# Altium schematic sheet Sheet1.SchDoc
size A4; SheetNumber: 1; SheetTotal: 1
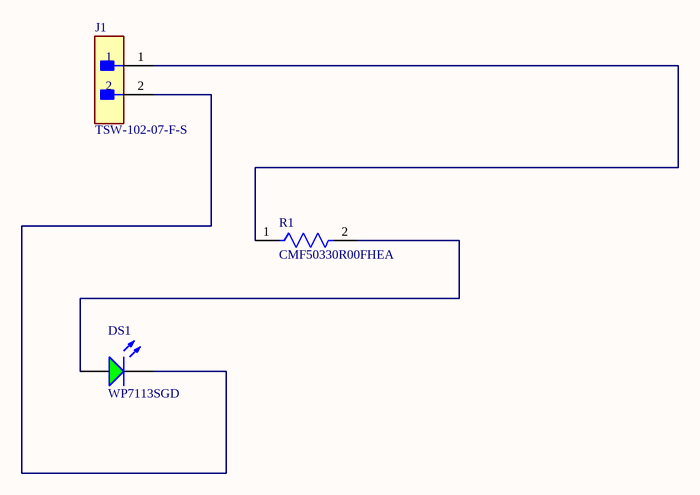
[diagram p0: Sheet1.SchDoc]

## Parts
DS1  WP7113SGD  [KING-WP7113SGD_V]
J1  TSW-102-07-F-S  [FP-TSW-102-07-F-S-MFG]
R1  CMF50330R00FHEA  [FP-CMF50-0]

## Nets
NetDS1_1: DS1.1(A) R1.2
NetDS1_2: DS1.2(K) J1.2
NetJ1_1: J1.1 R1.1

## Library data of the parts
DS1 = CMP-2100-03698-1: LED Green, 62.5 mW, 25 mA, -40 to 85 degC, 2-Pin THD, RoHS, Bulk; Manufacturer: Kingbright; Viewing Angle: 30degrees; Lens Style: Tinted; Test Current: 20mA; Forward Voltage: 2.2V; Wavelength: 568nm; Luminous Intensity: 40mcd; Package Reference: WP7113SGD; Colour: Green; Lead Free: LeadFree; Packaging: Bulk; RoHSCompliant: true; Package Quantity: 1000; Illumination Colour: Green; Case/Package: Radial; Datasheet URL: http://www.kingbrightusa.com/images/catalog/SPEC/WP7113SGD.pdf; Dominant Wavelength: 568nm; Datasheet Version: Rev. 6B, 01/2015; Package Description: 2-Pin Through Hole Device, Dia 5.9 mm, Body Length 8.6 mm; Height: 8.6mm
J1 = CMP-02766-001458-1: CONN HEADER VERT 2POS 2.54MM; Gender: Male; Max Current Rating: 7.6A; Number of Contacts: 2; Max Voltage Rating (AC): 550V; Orientation: Straight; Depth: 2.54mm; Series: TSW; Package Quantity: 1; Min Operating Temperature: -55°C; Max Operating Temperature: 125°C; Contact Type: Male Pin; Contact Shape: Square; Color: Black; Housing Color: Black; Connector Type: Header; Fastening Type: Pull; Radiation Hardening: No; Pitch: 2.54mm; Housing Material: Polyester; Mount: Through Hole; Number of Positions: 2; Number of Rows: 1; Contact Material: Bronze; Insulation Color: Black; Contact Finish - Mating: GOLD; Termination: Solder; Insulation Material: PBT; Length: 5.08mm; Flammability Rating: UL94 V-0; Contact Mating Length: 0.23inch; REACH SVHC: No SVHC; Contact Plating: Gold; RoHS Compliant: Yes; Packaging: Bulk
R1 = CMP-00030-45489944-1: CMF50330R00FHEA Res Mtlflm CMF-50 330 Ohm 1% T-2 Ea E3 Axl Th; Voltage Rating: 200V; Max Power Dissipation: 250mW; Temperature Coefficient: 50ppm/°C; Resistance: 330Ω; Packaging: Tape & Reel (TR); Number of Terminations: 2; Tolerance: 1%; Max Operating Temperature: 175°C; NexarPartId: 45489944; Height: 2.03mm; Width: 1.65mm; RoHS: Compliant; Composition: Metal Film; Length: 3.81mm; Case/Package: Axial; Lead Free: Lead Free; Min Operating Temperature: -55°C; Features: Flame Retardant Coating; Power Rating: 250mW